# EAGLE design Proppeler Clock (EAGLE 9.5.0)
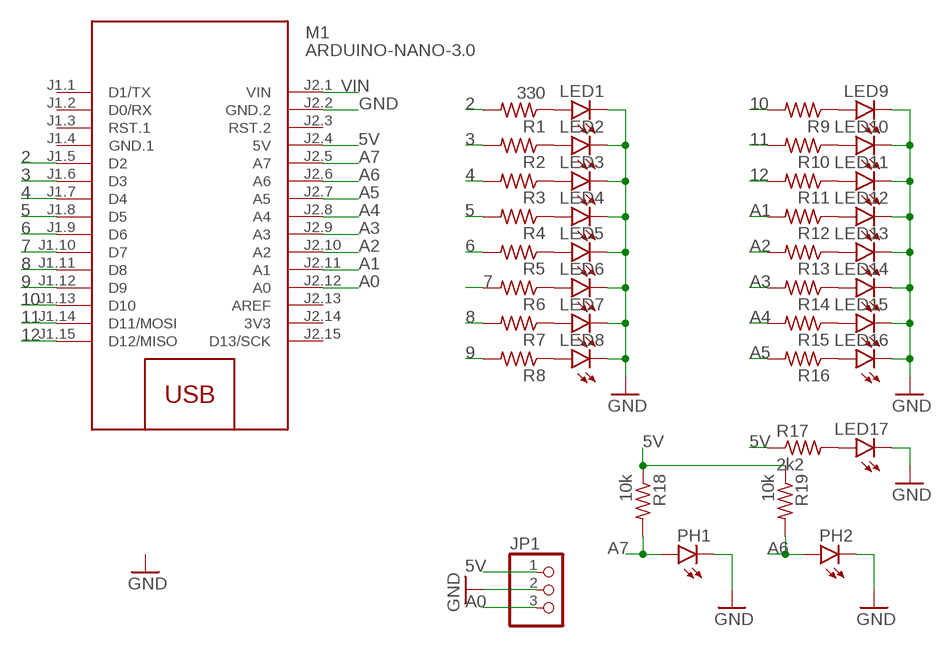
[diagram p0: schematic, sheet 1]

## Parts
JP1  PINHD-1X3  [1X03]
LED1  LED3MM  [LED3MM]
LED2  LED3MM  [LED3MM]
LED3  LED3MM  [LED3MM]
LED4  LED3MM  [LED3MM]
LED5  LED3MM  [LED3MM]
LED6  LED3MM  [LED3MM]
LED7  LED3MM  [LED3MM]
LED8  LED3MM  [LED3MM]
LED9  LED3MM  [LED3MM]
LED10  LED3MM  [LED3MM]
LED11  LED3MM  [LED3MM]
LED12  LED3MM  [LED3MM]
LED13  LED3MM  [LED3MM]
LED14  LED3MM  [LED3MM]
LED15  LED3MM  [LED3MM]
LED16  LED3MM  [LED3MM]
LED17  LED3MM  [LED3MM]
M1  ARDUINO-NANO-3.0  [ARDUINO-NANO-3.0]
PH1  LED3MM  [LED3MM]
PH2  LED3MM  [LED3MM]
R1  330  R-US_0204/7  [0204/7]
R2  R-US_0204/7  [0204/7]
R3  R-US_0204/7  [0204/7]
R4  R-US_0204/7  [0204/7]
R5  R-US_0204/7  [0204/7]
R6  R-US_0204/7  [0204/7]
R7  R-US_0204/7  [0204/7]
R8  R-US_0204/7  [0204/7]
R9  R-US_0204/7  [0204/7]
R10  R-US_0204/7  [0204/7]
R11  R-US_0204/7  [0204/7]
R12  R-US_0204/7  [0204/7]
R13  R-US_0204/7  [0204/7]
R14  R-US_0204/7  [0204/7]
R15  R-US_0204/7  [0204/7]
R16  R-US_0204/7  [0204/7]
R17  2k2  R-US_0204/7  [0204/7]
R18  10k  R-US_0204/7  [0204/7]
R19  10k  R-US_0204/7  [0204/7]

## Nets
2: M1.J1.5(D2) R1.2
3: M1.J1.6(D3) R2.2
4: M1.J1.7(D4) R3.2
5: M1.J1.8(D5) R4.2
5V: JP1.1 M1.J2.4(5V) R17.1 R18.1 R19.1
6: M1.J1.9(D6) R5.2
7: M1.J1.10(D7) R6.2
8: M1.J1.11(D8) R7.2
9: M1.J1.12(D9) R8.2
10: M1.J1.13(D10) R9.2
11: M1.J1.14(D11/MOSI) R10.2
12: M1.J1.15(D12/MISO) R11.2
A0: JP1.3 M1.J2.12(A0)
A1: M1.J2.11(A1) R12.2
A2: M1.J2.10(A2) R13.2
A3: M1.J2.9(A3) R14.2
A4: M1.J2.8(A4) R15.2
A5: M1.J2.7(A5) R16.2
A6: M1.J2.6(A6) PH2.A R19.2
A7: M1.J2.5(A7) PH1.A R18.2
GND: JP1.2 LED1.K(C) LED2.K(C) LED3.K(C) LED4.K(C) LED5.K(C) LED6.K(C) LED7.K(C) LED8.K(C) LED9.K(C) LED10.K(C) LED11.K(C) LED12.K(C) LED13.K(C) LED14.K(C) LED15.K(C) LED16.K(C) LED17.K(C) M1.J2.2(GND.2) PH1.K(C) PH2.K(C)
N$1: LED1.A R1.1
N$2: LED2.A R2.1
N$3: LED3.A R3.1
N$4: LED4.A R4.1
N$5: LED5.A R5.1
N$6: LED6.A R6.1
N$7: LED7.A R7.1
N$8: LED8.A R8.1
N$9: LED9.A R9.1
N$10: LED10.A R10.1
N$11: LED11.A R11.1
N$12: LED12.A R12.1
N$13: LED13.A R13.1
N$14: LED14.A R14.1
N$15: LED15.A R15.1
N$16: LED16.A R16.1
N$20: LED17.A R17.2
VIN: M1.J2.1(VIN)
Unconnected: M1.J1.1(D1/TX) M1.J1.2(D0/RX) M1.J1.3(RST.1) M1.J2.3(RST.2) M1.J2.13(AREF) M1.J2.15(D13/SCK)

## Power pins joined to a net without a drawn wire
3V3: M1.J2.14(3V3)
GND.1: M1.J1.4(GND.1)

## Library data of the parts
JP1 = pinhead:PINHD-1X3: PIN HEADER
LED1-LED17 PH1 PH2 = led:LED: LED OSRAM: - CHIPLED LG R971, LG N971, LY N971, LG Q971, LY Q971, LO R971, LY R971 LH N974, LH R974 LS Q976, LO Q976, LY Q976 LO Q996 - Hyper CHIPLED LW Q18S LB Q993, LB Q99A, LB R99A - SideLED LS A670, LO A670, LY A670, LG A670, LP A670 LB A673, LV A673, LT A673, LW A673 LH A674 LY A675 LS A676, LA A676, LO A676, LY A676, LW A676 LS A679, LY A679, LG A679 - Hyper Micro SIDELED® LS Y876, LA Y876, LO Y876, LY Y876 LT Y87S - SmartLED LW L88C, LW L88S LB L89C, LB L89S, LG L890 LS L89K, LO L89K, LY L89K LS L896, LA L896, LO L896, LY L896 - TOPLED LS T670, LO T670, LY T670, LG T670, LP T670 LSG T670, LSP T670, LSY T670, LOP T670, LYG T670 LG T671, LOG T671, LSG T671 LB T673, LV T673, LT T673, LW T673 LH T674 LS T676, LA T676, LO T676, LY T676, LB T676, LH T676, LSB T676, LW T676 LB T67C, LV T67C, LT T67C, LS T67K, LO T67K, LY T67K, LW E67C LS E67B, LA E67B, LO E67B, LY E67B, LB E67C, LV E67C, LT E67C LW T67C LS T679, LY T679, LG T679 LS T770, LO T770, LY T770, LG T770, LP T770 LB T773, LV T773, LT T773, LW T773 LH T774 LS E675, LA E675, LY E675, LS T675 LS T776, LA T776, LO T776, LY T776, LB T776 LHGB T686 LT T68C, LB T68C - Hyper Mini TOPLED® LB M676 - Mini TOPLED Santana® LG M470 LS M47K, LO M47K, LY M47K Source: http://www.osram.convergy.de LUXEON: - LUMILED® LXK2-PW12-R00, LXK2-PW12-S00, LXK2-PW14-U00, LXK2-PW14-V00 LXK2-PM12-R00, LXK2-PM12-S00, LXK2-PM14-U00 LXK2-PE12-Q00, LXK2-PE12-R00, LXK2-PE12-S00, LXK2-PE14-T00, LXK2-PE14-U00 LXK2-PB12-K00, LXK2-PB12-L00, LXK2-PB12-M00, LXK2-PB14-N00, LXK2-PB14-P00, LXK2-PB14-Q00 LXK2-PR12-L00, LXK2-PR12-M00, LXK2-PR14-Q00, LXK2-PR14-R00 LXK2-PD12-Q00, LXK2-PD12-R00, LXK2-PD12-S00 LXK2-PH12-R00, LXK2-PH12-S00 LXK2-PL12-P00, LXK2-PL12-Q00, LXK2-PL12-R00 Source: www.luxeon.com KINGBRIGHT: KA-3528ASYC Source: www.kingbright.com
M1 = diy-modules:ARDUINO-NANO-3.0: Arduino Nano 3.0 and compatible devices More details available here: https://www.arduino.cc/en/Main/ArduinoBoardNano Click here to find device on ebay.com <http://www.ebay.com/sch/arduino+nano>
R1-R19 = rcl:R-US_: RESISTOR, American symbol; SPICEPREFIX: R

## Board
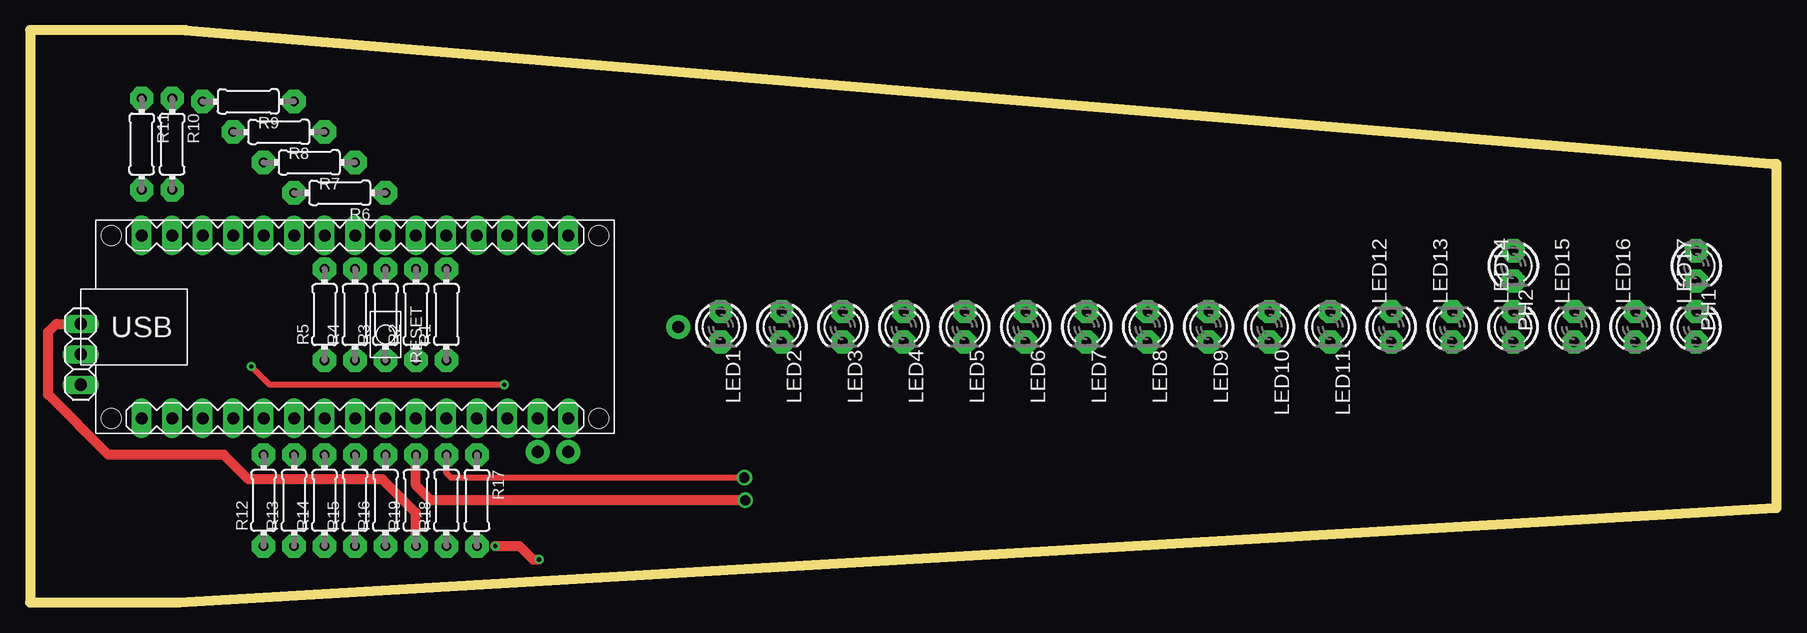
[diagram p1: board, top side]
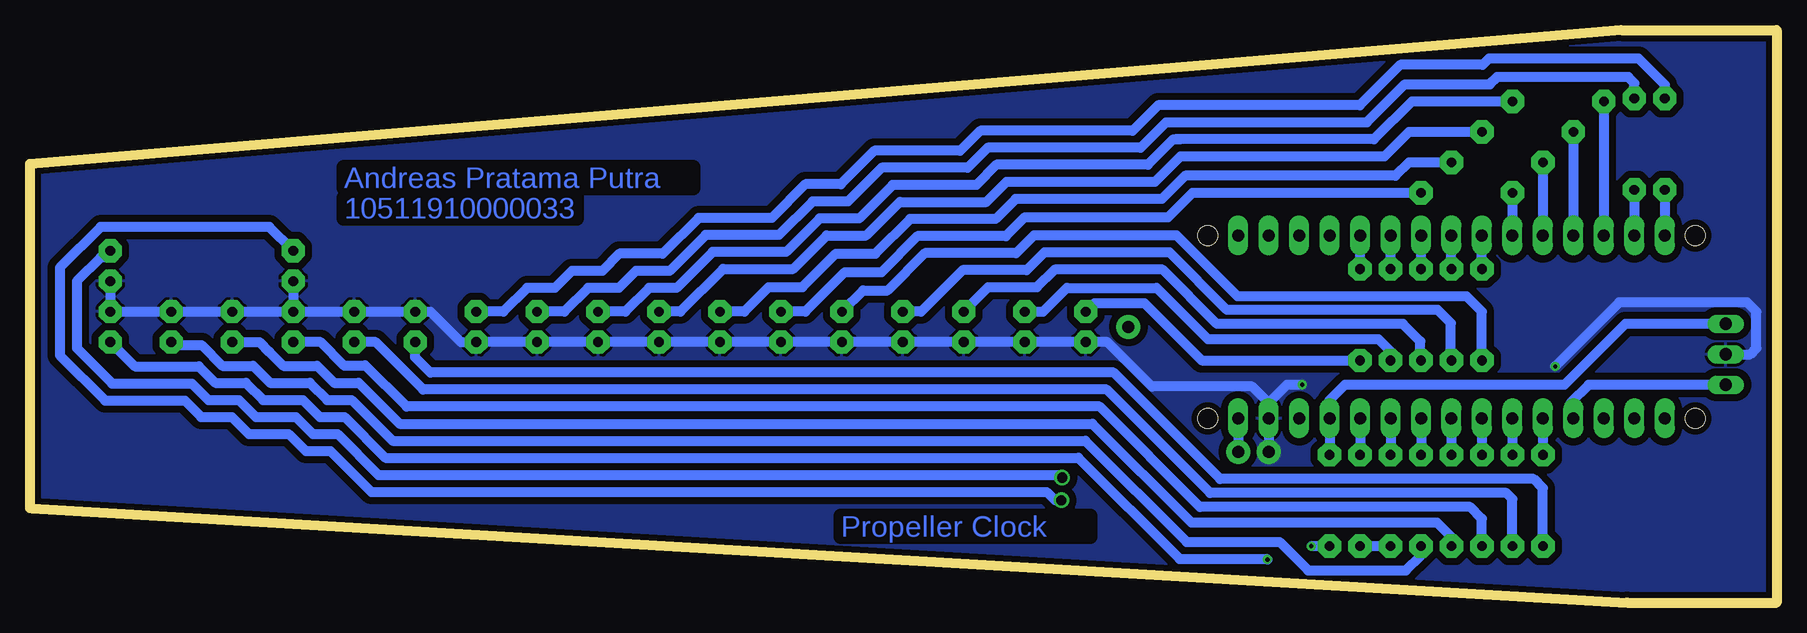
[diagram p2: board, bottom side, seen from below]

Size 145.54 x 47.75 mm. Coordinates in mm from the lower left corner, seen from the top.
Outline: 145.41,7.87 12.45,0 0,0 0,47.75 12.95,47.75 145.54,36.58
Outline: 145.54,7.87 145.54,36.58
Outline: 145.54,36.58 145.29,36.58
Copper layers (1*16): Top 0.035mm / dielectric 1.5mm / Bottom 0.035mm
Design rules "default *": minimum track width 6mil, minimum drill 0.35mm, track to track 24mil, track to pad 24mil, pad to pad 24mil, via to via 24mil, smd to smd 24mil, copper to edge 20mil, drill to drill 6mil, minimum pad ring 10mil, minimum via ring 8mil, stop-mask expansion 4mil, vias tented up to drill 0mil, thermal gap 10mil

### Footprints (pad centres in the part's own frame; a part is rotated, then mirrored left to right if it is on the bottom)
1X03 = drill 1.016 long: 1 -2.54,0; 2 0,0; 3 2.54,0
LED3MM = drill 0.813 pad 1.93 octagon: A -1.27,0; K 1.27,0
ARDUINO-NANO-3.0 = drill 1 pad 1.676 long: J1.1 17.78,7.62; J1.2 15.24,7.62; J1.3 12.7,7.62; J1.4 10.16,7.62; J1.5 7.62,7.62; J1.6 5.08,7.62; J1.7 2.54,7.62; J1.8 0,7.62; J1.9 -2.54,7.62; J1.10 -5.08,7.62; J1.11 -7.62,7.62; J1.12 -10.16,7.62; J1.13 -12.7,7.62; J1.14 -15.24,7.62; J1.15 -17.78,7.62; J2.1 17.78,-7.62; J2.2 15.24,-7.62; J2.3 12.7,-7.62; J2.4 10.16,-7.62; J2.5 7.62,-7.62; J2.6 5.08,-7.62; J2.7 2.54,-7.62; J2.8 0,-7.62; J2.9 -2.54,-7.62; J2.10 -5.08,-7.62; J2.11 -7.62,-7.62; J2.12 -10.16,-7.62; J2.13 -12.7,-7.62; J2.14 -15.24,-7.62; J2.15 -17.78,-7.62 | hole 1.651: -20.32,7.62; -20.32,-7.62; 20.32,-7.62; 20.32,7.62
0204/7 = drill 0.813 pad 1.93 octagon: 1 -3.81,0; 2 3.81,0

### Placement (x,y rotation side)
JP1  4.22,20.71 270 top
LED1  57.56,22.99 270 top
LED2  62.64,22.99 270 top
LED3  67.72,22.99 270 top
LED4  72.8,22.99 270 top
LED5  77.88,22.99 270 top
LED6  82.96,22.99 270 top
LED7  88.04,22.99 270 top
LED8  93.12,22.99 270 top
LED9  98.2,22.99 270 top
LED10  103.28,22.99 270 top
LED11  108.36,22.99 270 top
LED12  113.44,22.99 90 top
LED13  118.52,22.99 90 top
LED14  123.6,22.99 90 top
LED15  128.68,22.99 90 top
LED16  133.76,22.99 90 top
LED17  138.84,22.99 90 top
M1  27.08,22.99 0 top
PH1  138.84,28.07 270 top
PH2  123.6,28.07 270 top
R1  34.7,24.01 90 top
R2  32.16,24.01 90 top
R3  29.62,24.01 90 top
R4  27.08,24.01 90 top
R5  24.54,24.01 90 top
R6  25.81,34.17 180 top
R7  23.27,36.71 180 top
R8  20.73,39.25 180 top
R9  18.19,41.79 180 top
R10  11.84,38.23 270 top
R11  9.3,38.23 270 top
R12  19.46,8.51 90 top
R13  22,8.51 90 top
R14  24.54,8.51 90 top
R15  27.08,8.51 90 top
R16  29.62,8.51 90 top
R17  37.24,8.51 270 top
R18  34.7,8.51 90 top
R19  32.16,8.51 90 top

### Tracks (layer width: path | path; a pad name or v marks a point on that pad's centre or on a via)
2
  Bottom 0.813: R1.2 M1.J1.5
3
  Bottom 0.813: R2.2 M1.J1.6
4
  Bottom 0.813: R3.2 M1.J1.7
5
  Bottom 0.813: R4.2 M1.J1.8
5V
  Top 0.813: R19.1 32.16,7.5 29.37,10.29 18.19,10.29 16.16,12.32 6.54,12.32 1.51,17.35 1.51,22.57 2.19,23.25 JP1.1
  Bottom 0.813: R17.1 M1.J2.4 37.24,16.9 35.97,18.17 17.68,18.17 12.6,23.25 JP1.1 | R19.1 R18.1
6
  Bottom 0.813: R5.2 M1.J1.9
7
  Bottom 0.813: R6.2 M1.J1.10
8
  Bottom 0.813: R7.2 M1.J1.11
9
  Bottom 0.813: R8.2 M1.J1.12
10
  Bottom 0.813: R9.2 M1.J1.13
11
  Bottom 0.813: R10.2 M1.J1.14
12
  Bottom 0.813: R11.2 M1.J1.15
A0
  Bottom 0.813: JP1.3 15.65,18.17 17.18,16.64 17.18,15.63 M1.J2.12
A1
  Bottom 0.813: M1.J2.11 R12.2
A2
  Bottom 0.813: M1.J2.10 R13.2
A3
  Bottom 0.813: M1.J2.9 R14.2
A4
  Bottom 0.813: M1.J2.8 R15.2
A5
  Bottom 0.813: M1.J2.7 R16.2
A6  (via drill 0.85 pad 0.6)
  Top 0.508: 32.16,12.07 R19.2
  Top 0.813: v59.6,8.53 33.42,8.53 32.16,9.78 32.16,12.07
  Bottom 0.813: M1.J2.6 R19.2 | PH2.A 125.58,31.32 139.66,31.32 143.06,27.93 143.06,20.62 139.28,16.84 132.64,16.84 131.27,15.47 128.72,15.47 127.3,14.05 123.98,14.05 122.56,12.63 120.5,12.63 117.1,9.22 60.81,9.22 60.12,8.53 v59.6,8.53
A7  (via drill 0.85 pad 0.6)
  Top 0.508: v59.53,10.42 35.09,10.42 34.7,10.8 R18.2
  Bottom 0.508: 59.53,10.65 v59.53,10.42
  Bottom 0.813: M1.J2.5 R18.2 | PH1.A 139.4,28.78 139.66,28.78 141.64,26.81 141.64,21.21 138.69,18.27 132.06,18.27 130.68,16.9 128.13,16.9 126.71,15.47 123.39,15.47 121.97,14.05 119.92,14.05 116.51,10.65 59.53,10.65
GND  (via drill 0.35, 1 pad 2)
  Top 0.508: v18.45,19.69 19.97,18.17 v39.53,18.17
  Bottom 0.813: 42.32,16.64 M1.J2.2 v42.32,12.58 | 42.32,16.64 43.7,18.01 52.05,18.01 55.76,21.72 LED1.K LED2.K LED3.K LED4.K | 73.31,21.72 LED4.K | LED4.K LED5.K LED6.K 88.3,21.72 88.55,21.47 | LED7.K LED8.K LED9.K | LED9.K 98.97,21.72 | LED9.K LED10.K LED11.K 109.63,21.72 112.17,24.26 LED12.K LED13.K LED14.K | PH1.K LED17.K LED16.K LED15.K LED14.K | LED14.K 123.1,24.26 | PH2.K LED14.K | JP1.2 2.19,20.71 1.68,21.21 1.68,24.26 2.45,25.02 13.11,25.02 v18.45,19.69 | v39.53,18.17 40.8,18.17 42.32,16.64
  pour Bottom: 0,49.78 144.78,37.08 144.78,6.6 0,-1.02
N$1
  Bottom 0.813: LED1.A 56.85,24.97 52.68,24.97 47.9,20.2 R1.1
N$2
  Bottom 0.813: LED2.A 61.12,24.26 59.14,26.24 51.66,26.24 47.4,21.98 33.18,21.98 32.16,20.96 R2.1
N$3
  Bottom 0.813: R3.1 29.68,20.25 29.68,21.78 31.14,23.25 46.64,23.25 51.16,27.77 60.16,27.77 61.63,26.29 65.69,26.29 LED3.A
N$4
  Bottom 0.813: R4.1 27.14,20.25 27.14,23.3 28.25,24.41 45.8,24.41 50.57,29.19 61.02,29.19 62.49,27.72 67.83,27.72 71.29,24.26 LED4.A
N$5
  Bottom 0.813: LED5.A 76.11,26.04 74.07,26.04 70.97,29.14 63.35,29.14 61.88,30.61 49.98,30.61 44.91,25.53 25.81,25.53 24.54,24.26 R5.1
N$6
  Bottom 0.813: R6.1 48.67,34.17 50.71,32.14 62.64,32.14 64.22,30.56 71.58,30.56 74.58,27.56 77.63,27.56 80.93,24.26 LED6.A
N$7
  Bottom 0.813: LED7.A 86.01,24.26 83.98,26.29 81.19,26.29 78.39,29.09 75.09,29.09 72.19,31.98 65.08,31.98 63.41,33.66 51.21,33.66 49.28,35.59 31.76,35.59 30.64,36.71 R7.1
N$8
  Bottom 0.813: LED8.A 91.35,24.26 87.79,27.82 81.95,27.82 79.15,30.61 75.86,30.61 73.06,33.41 65.84,33.41 64.17,35.08 51.8,35.08 49.68,37.21 32.68,37.21 30.64,39.25 R8.1
N$9
  Bottom 0.813: LED9.A 95.93,24.26 93.94,26.24 91.65,26.24 88.65,29.24 82.54,29.24 79.74,32.03 76.45,32.03 73.65,34.83 66.68,34.83 65.01,36.51 52.39,36.51 50.27,38.63 49.69,38.63 | 49.69,38.63 33.55,38.63 30.39,41.79 R9.1 | 49.69,38.63 50.09,38.63 | 49.69,38.63
N$10
  Bottom 0.813: LED10.A 101.01,24.26 99.03,26.24 96.48,26.24 95.05,27.67 92.24,27.67 89.24,30.66 83.13,30.66 80.33,33.46 77.38,33.46 74.58,36.26 67.42,36.26 65.74,37.93 52.98,37.93 50.86,40.05 34.13,40.05 30.98,43.21 23.88,43.21 23.27,43.82 12.35,43.82 11.84,43.31 R10.1
N$11
  Bottom 0.813: R11.1 9.3,43.19 11.49,45.37 23.97,45.37 24.49,44.85 31.35,44.85 34.72,41.47 51.53,41.47 53.65,39.35 66.35,39.35 68.03,37.68 75.17,37.68 77.97,34.88 80.92,34.88 83.72,32.09 89.83,32.09 92.83,29.09 96.43,29.09 97.85,27.67 100.39,27.67 101.81,26.24 104.11,26.24 106.09,24.26 LED11.A
N$12
  Bottom 0.813: R12.1 19.46,9.53 20.24,10.31 46.36,10.31 55.23,19.18 112.17,19.18 113.44,20.45 LED12.A
N$13
  Bottom 0.813: R13.1 22,8.63 22.51,9.14 47.2,9.14 55.82,17.76 112.78,17.76 116.75,21.72 LED13.A
N$14
  Bottom 0.813: R14.1 24.54,6.99 25.52,7.97 48.05,7.97 56.41,16.34 114.16,16.34 117.63,19.81 117.7,19.74 119.34,19.74 121.33,21.72 LED14.A
N$15
  Bottom 0.813: LED15.A 126.4,21.72 125.58,20.91 125.58,20.9 124.42,19.74 121.62,19.74 120.2,18.32 118.15,18.32 114.74,14.91 57,14.91 48.75,6.66 28.28,6.66 27.08,5.47 R15.1
N$16
  Bottom 0.813: LED16.A 133.51,21.47 131.23,21.47 129.5,19.74 126.96,19.74 125.53,18.32 122.21,18.32 120.79,16.9 118.74,16.9 115.33,13.49 57.59,13.49 49.16,5.06 41.41,5.06 39.02,2.67 30.89,2.67 29.62,3.94 R16.1
N$17  (via drill 1 pad 2)
  other vias: 54.01,22.99
N$20  (via drill 0.35)
  Top 0.813: v42.42,3.59 41.91,3.59 40.8,4.7 v38.77,4.7
  Bottom 0.813: LED17.A 136.81,19.69 131.47,19.69 130.09,18.32 127.55,18.32 126.12,16.9 122.8,16.9 121.38,15.47 119.33,15.47 115.92,12.07 58.18,12.07 49.75,3.64 42.47,3.64 v42.42,3.59 | R17.2 v38.77,4.7
VIN  (via drill 1 pad 2)
  Bottom 0.813: M1.J2.1 v44.86,12.58

### Text on the board
Bottom: Andreas Pratama Putra | 10511910000033 | Propeller Clock